# EAGLE design Filter Board (EAGLE 6.0)
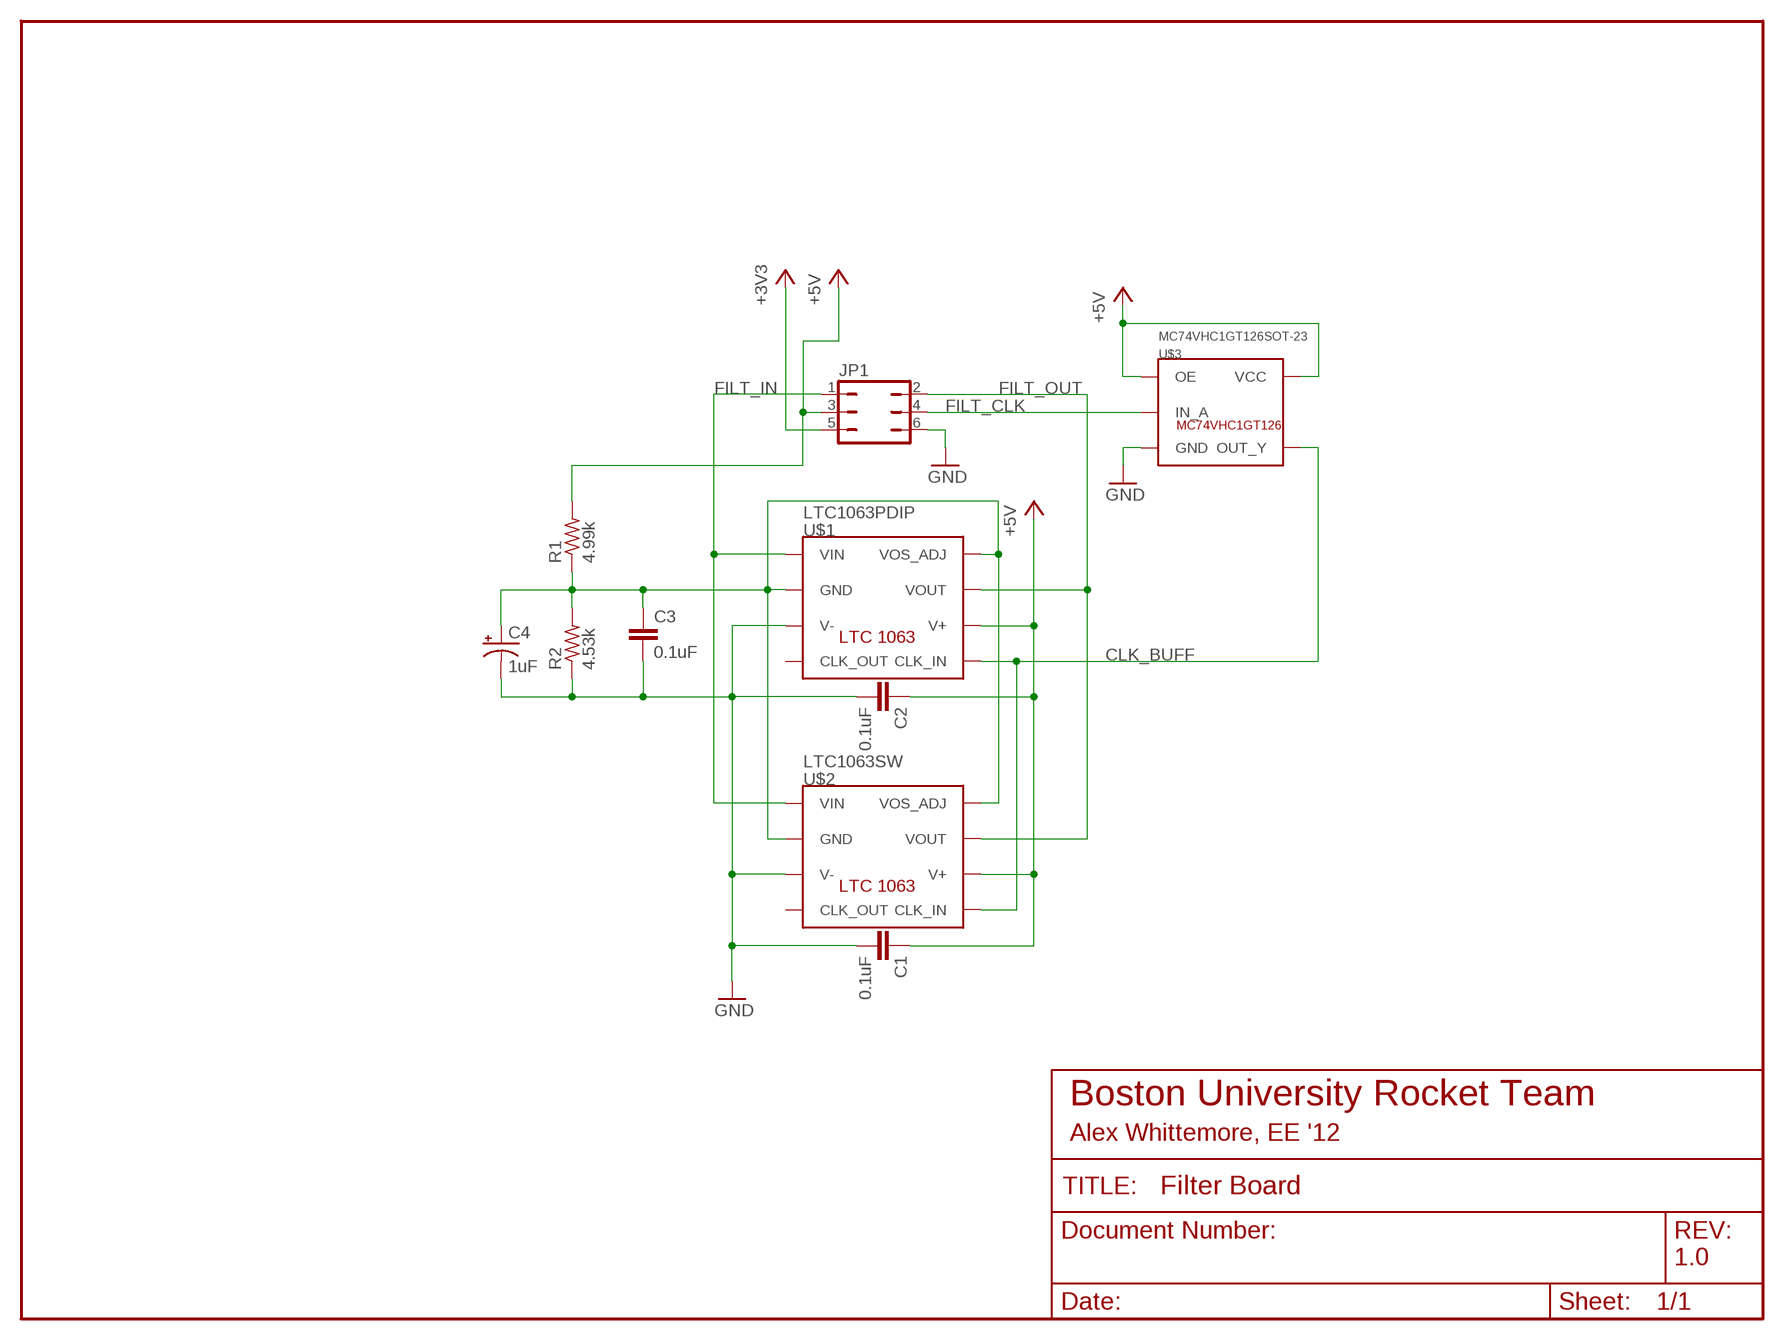
[diagram p0: schematic, sheet 1]

## Parts
C1  0.1uF  CAP0402-CAP  [0402-CAP]
C2  0.1uF  CAP0402-CAP  [0402-CAP]
C3  0.1uF  CAP0402-CAP  [0402-CAP]
C4  1uF  CAP_POL1206  [EIA3216]
JP1  JP3Q  [JP3Q]
R1  4.99k  R-US_0207/7  [0207/7]
R2  4.53k  R-US_0207/7  [0207/7]
U$1  LTC1063PDIP  [SOCKED-08]
U$2  LTC1063SW  [SOP16]
U$3  MC74VHC1GT126SOT-23  [SOT23-5L]

## Nets
+3V3: JP1.5
+5V: C1.1 C2.1 JP1.3 R1.2 U$1.6(V+) U$2.12(V+) U$3.1(OE) U$3.5(VCC)
CLK_BUFF: U$1.5(CLK_IN) U$2.9(CLK_IN) U$3.4(OUT_Y)
FILT_CLK: JP1.4 U$3.2(IN_A)
FILT_IN: JP1.1 U$1.1(VIN) U$2.2(VIN)
FILT_OUT: JP1.2 U$1.7(VOUT) U$2.14(VOUT)
GND: C1.2 C2.2 C3.2 C4.C(-) JP1.6 R2.1 U$1.3(V-) U$2.5(V-) U$3.3(GND)
N$1: C3.1 C4.A(+) R1.1 R2.2 U$1.2(GND) U$1.8(VOS_ADJ) U$2.3(GND) U$2.16(VOS_ADJ)
Unconnected: U$1.4(CLK_OUT) U$2.8(CLK_OUT)

## Notes on the sheet
- Boston University Rocket Team
- Alex Whittemore, EE '12
- 1.0

## Library data of the parts
C1-C3 = SparkFun:CAP: Capacitor Standard 0603 ceramic capacitor, and 0.1" leaded capacitor.
C4 = SparkFun:CAP_POL: Capacitor Polarized These are standard SMD and PTH capacitors. Normally 10uF, 47uF, and 100uF in electrolytic and tantalum varieties. Always verify the external diameter of the through hole cap, it varies with capacity, voltage, and manufacturer. The EIA devices should be standard.
JP1 = jumper:JP3Q: JUMPER
R1 R2 = resistor:R-US_: RESISTOR, American symbol
U$1 U$2 = AlexsParts:LTC1063
U$3 = AlexsParts:MC74VHC1GT126

## Board
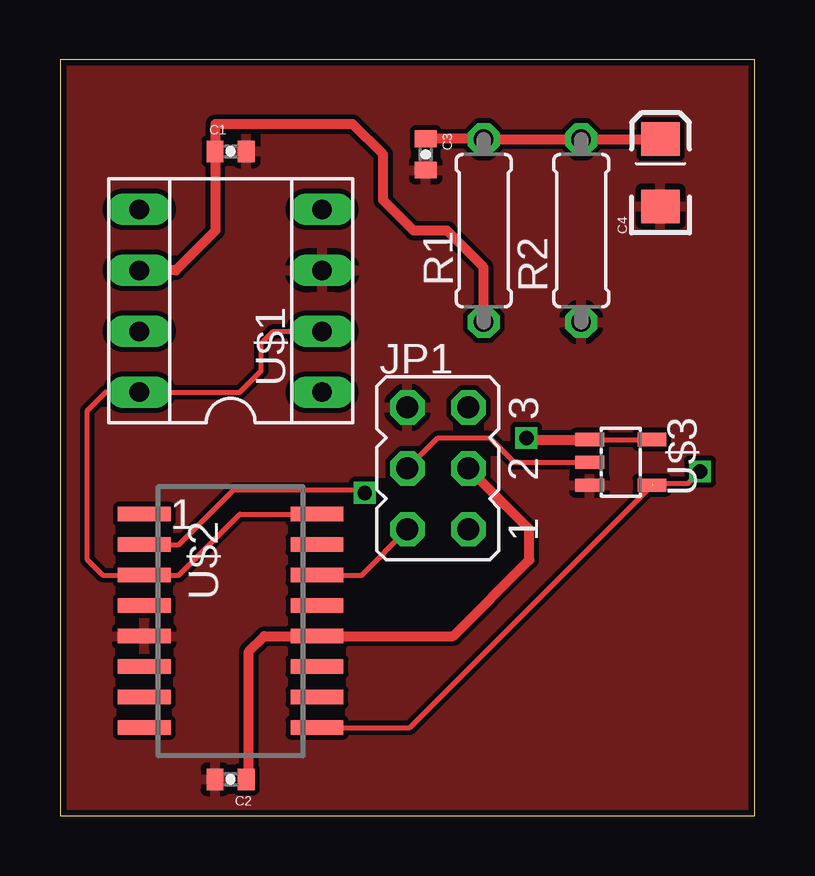
[diagram p1: board, top side]
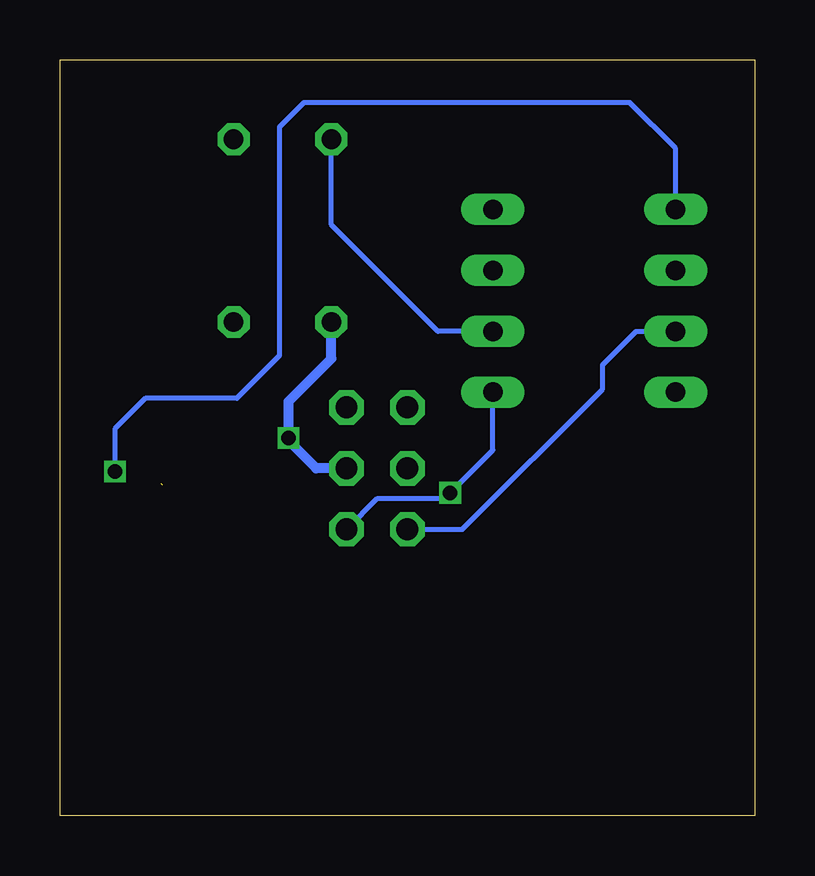
[diagram p2: board, bottom side, seen from below]

Size 28.96 x 31.5 mm. Coordinates in mm from the lower left corner, seen from the top.
Outline: 0,0 28.96,0 28.96,31.5 0,31.5 0,0
Copper layers (1*16): Top 0.035mm / dielectric 1.5mm / Bottom 0.035mm
Design rules: minimum track width 6mil, minimum drill 12mil, track to track 8mil, track to pad 8mil, pad to pad 8mil, via to via 8mil, smd to smd 0mil, copper to edge 10mil, drill to drill 10mil, minimum pad ring 10mil, minimum via ring 6mil, stop-mask expansion 2mil, vias tented up to drill 100mil, thermal gap 10mil

### Footprints (pad centres in the part's own frame; a part is rotated, then mirrored left to right if it is on the bottom)
0402-CAP = smd 0.7 x 0.9: 1 -0.65,0; 2 0.65,0
EIA3216 = smd 1.4 x 1.6: A 1.4,0; C -1.4,0
JP3Q = drill 0.914 octagon: 1 -2.54,-1.27; 2 -2.54,1.27; 3 0,-1.27; 4 0,1.27; 5 2.54,-1.27; 6 2.54,1.27
0207/7 = drill 0.813 octagon: 1 -3.81,0; 2 3.81,0
SOCKED-08 = drill 0.813 long: 1 -3.81,-3.81; 2 -1.27,-3.81; 3 1.27,-3.81; 4 3.81,-3.81; 5 3.81,3.81; 6 1.27,3.81; 7 -1.27,3.81; 8 -3.81,3.81
SOP16 = smd 0.6 x 2.2: 1 -4.445,-3.6; 2 -3.175,-3.6; 3 -1.905,-3.6; 4 -0.635,-3.6; 5 0.635,-3.6; 6 1.905,-3.6; 7 3.175,-3.6; 8 4.445,-3.6; 9 4.445,3.6; 10 3.175,3.6; 11 1.905,3.6; 12 0.635,3.6; 13 -0.635,3.6; 14 -1.905,3.6; 15 -3.175,3.6; 16 -4.445,3.6
SOT23-5L = smd 0.55 x 1.2: 1 -0.95,-1.3; 2 0,-1.3; 3 0.95,-1.3; 4 0.95,1.3; 5 -0.95,1.3

### Placement (x,y rotation side)
C1  7.11,27.69 0 top
C2  7.11,1.52 180 top
C3  15.24,27.56 270 top
C4  25.02,26.8 90 top
JP1  15.75,14.48 90 top
R1  17.65,24.38 270 top
R2  21.72,24.38 90 top
U$1  7.11,21.46 90 top
U$2  7.11,8.13 270 top
U$3  23.37,14.73 270 top

### Tracks (layer width: path | path; a pad name or v marks a point on that pad's centre or on a via)
+5V  (via drill 0.6)
  Top 0.203: U$3.1 U$3.5
  Top 0.406: U$1.6 4.83,22.73 6.48,24.38 6.48,27.67 C1.1 6.48,27.7 6.48,28.83 12.19,28.83 13.46,27.56 13.46,25.65 14.73,24.38 16.13,24.38 17.65,22.86 R1.2 | C2.1 7.87,1.64 7.87,6.86 8.51,7.49 U$2.12 16.38,7.49 19.56,10.67 19.56,11.94 JP1.3 | U$3.1 19.5,15.68 v19.43,15.75
  Bottom 0.406: R1.2 17.65,19.05 19.43,17.27 19.43,16.13 v19.43,15.75 19.43,15.62 18.29,14.48 JP1.3
CLK_BUFF  (via drill 0.6)  (1 unrouted)
  Top 0.203: 24.73,13.84 26.16,13.84 v26.67,14.35 | U$2.9 14.57,3.68 U$3.4
  Bottom 0.203: U$1.5 3.3,27.81 5.21,29.72 18.8,29.72 19.81,28.7 19.81,19.18 21.59,17.4 25.4,17.4 26.67,16.13 v26.67,14.35
FILT_CLK
  Top 0.203: JP1.4 15.75,15.75 17.91,15.75 18.92,14.73 U$3.2
FILT_IN  (via drill 0.6)
  Top 0.203: U$2.2 4.95,11.3 7.24,13.59 12.57,13.59 v12.7,13.46
  Bottom 0.203: U$1.1 10.92,15.24 v12.7,13.46 12.95,13.21 15.75,13.21 JP1.1
FILT_OUT
  Top 0.203: U$2.14 12.57,10.03 JP1.2
  Bottom 0.203: U$1.7 4.95,20.19 6.35,18.8 6.35,17.78 12.19,11.94 JP1.2
GND
  pour Top: 0,0 29.34,0 29.34,31.75 0,31.75
N$1
  Top 0.203: U$1.2 8.89,20.19 8.38,19.68 8.38,18.54 7.49,17.65 U$1.8 1.91,17.65 1.14,16.89 1.14,10.67 1.78,10.03 U$2.3 4.95,10.03 7.49,12.57 U$2.16
  Top 0.406: C3.1 17.64,28.21 R1.1 R2.2 C4.A
  Bottom 0.203: U$1.2 13.21,20.19 17.65,24.64 R1.1

### Text on the board
tValues: BURT Clocked Filter | Rev 1.0 | CC-BY-SA | Alex Whittemore EE'12 | www.bu.edu/rocket